# Altium schematic sheet 2. Input Section.SchDoc
size A4; SheetNumber: 2; SheetTotal: 6; PageSetup: Record=PageOptions|CenterHorizontal=True|CenterVertical=True|PrintScale=1.00|XCorrection=1.00|YCorrection=1.00|PrintKind=0|BorderSize=5000000|LeftOffset=0|BottomOffset=0|Orientation=2|PaperLength=1000|PaperWidth=1000|Scale=100|PaperSource=7|PrintQuality=-3|MediaType=1|DitherType=10|PrintScaleMode=1|PaperKind=A4|PaperIndex=9
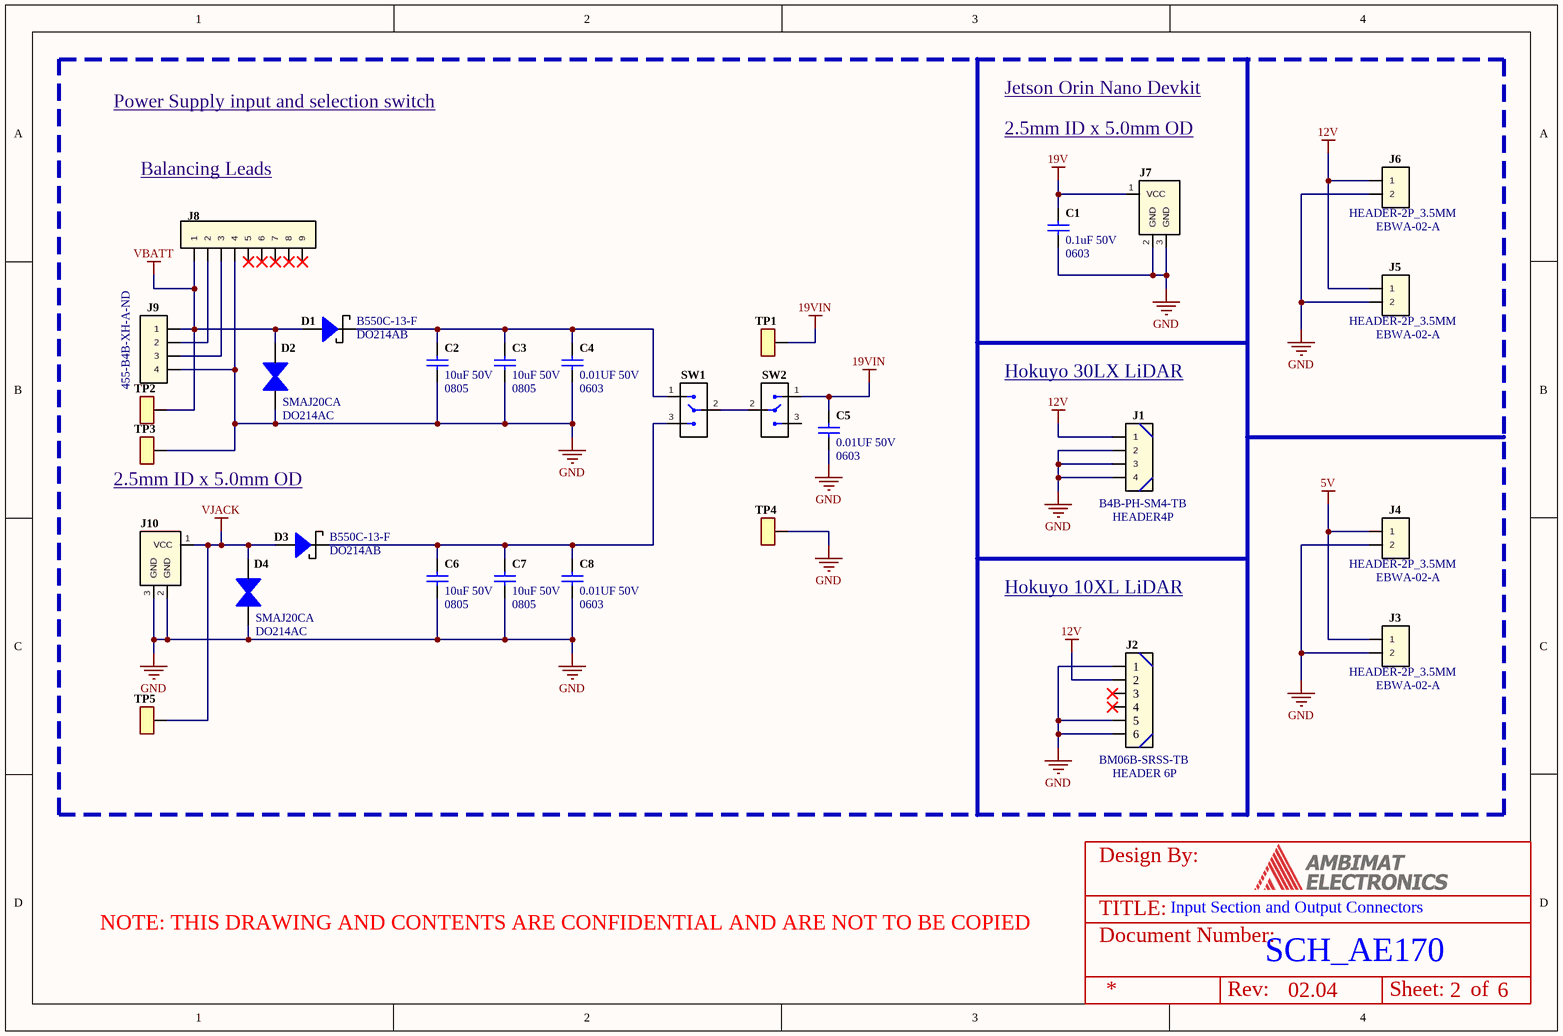
[diagram p0: 2. Input Section.SchDoc]

## Parts
C1  Part Name: 0.1uF 50V  PCB Footprint: 0603  [0603C]  (hidden comment: CAP CER 0.1UF 50V X7R 0603)
C2  Part Name: 10uF 50V  PCB Footprint: 0805  [0805C]  (hidden comment: CAP CER 10UF 50V X5R 0805)
C3  Part Name: 10uF 50V  PCB Footprint: 0805  [0805C]  (hidden comment: CAP CER 10UF 50V X5R 0805)
C4  Part Name: 0.01UF 50V  PCB Footprint: 0603  [0603C]  (hidden comment: CAP CER 10000PF 50V X7R 0603)
C5  Part Name: 0.01UF 50V  PCB Footprint: 0603  [0603C]  (hidden comment: CAP CER 10000PF 50V X7R 0603)
C6  Part Name: 10uF 50V  PCB Footprint: 0805  [0805C]  (hidden comment: CAP CER 10UF 50V X5R 0805)
C7  Part Name: 10uF 50V  PCB Footprint: 0805  [0805C]  (hidden comment: CAP CER 10UF 50V X5R 0805)
C8  Part Name: 0.01UF 50V  PCB Footprint: 0603  [0603C]  (hidden comment: CAP CER 10000PF 50V X7R 0603)
D1  PCB Footprint: DO214AB  Part Name: B550C-13-F  [DO-214AB-SHKY]  (hidden comment: DIODE SCHOTTKY 50V 5A SMC)
D2  PCB Footprint: DO214AC  Part Name: SMAJ20CA  [DO-214AC]  (hidden comment: TVS DIODE 20VWM 32.4VC DO214AC)
D3  PCB Footprint: DO214AB  Part Name: B550C-13-F  [DO-214AB-SHKY]  (hidden comment: DIODE SCHOTTKY 50V 5A SMC)
D4  PCB Footprint: DO214AC  Part Name: SMAJ20CA  [DO-214AC]  (hidden comment: TVS DIODE 20VWM 32.4VC DO214AC)
J1  Manu Part Number: B4B-PH-SM4-TB  Part Name: HEADER4P  [JST_B4B-PH-SM4-TB]  (hidden comment: CONN HEADER SMD 4POS 2MM)
J2  Manu Part Number: BM06B-SRSS-TB  PCB Footprint: HEADER 6P  [BM06B-SRSS-TB_JST]  (hidden comment: CONN HEADER SMD 6POS 1MM)
J3  Manu Part Number: EBWA-02-A  PCB Footprint: HEADER-2P_3.5MM  [Header3.5]  (hidden comment: EURO BLOCK 2P)
J4  Manu Part Number: EBWA-02-A  PCB Footprint: HEADER-2P_3.5MM  [Header3.5]  (hidden comment: EURO BLOCK 2P)
J5  Manu Part Number: EBWA-02-A  PCB Footprint: HEADER-2P_3.5MM  [Header3.5]  (hidden comment: EURO BLOCK 2P)
J6  Manu Part Number: EBWA-02-A  PCB Footprint: HEADER-2P_3.5MM  [Header3.5]  (hidden comment: EURO BLOCK 2P)
J7  CONN PWR JACK 2.5X5.5MM SOLDER  [PJ-050BH]  (value not drawn)
J8  HEADER 1x9  [HEADER-9P_2.54MM]  (value not drawn)
J9  Vendor-1 Part Number: 455-B4B-XH-A-ND  [JST_B4B-XH-A]  (hidden comment: CONN HEADER VERT 4POS 2.5MM)
J10  CONN PWR JACK 2.5X5.5MM SOLDER  [PJ-050BH]  (value not drawn)
SW1  SWITCH TOGGLE SPDT 7.5A 125V  [E101SYZQE]  (value not drawn)
SW2  SWITCH TOGGLE SPDT 7.5A 125V  [E101SYZQE]  (value not drawn)
TP1  TEST POINT  [TP-1.5mmSMD]  (value not drawn)
TP2  TEST POINT  [TP-1.5mmSMD]  (value not drawn)
TP3  TEST POINT  [TP-1.5mmSMD]  (value not drawn)
TP4  TEST POINT  [TP-1.5mmSMD]  (value not drawn)
TP5  TEST POINT  [TP-1.5mmSMD]  (value not drawn)

## Nets
5V: J3.1 J4.1
12V: J1.1 J2.2 J5.1 J6.1
19V: C1.2 J7.1(VCC)
19VIN: C5.1 SW2.1 TP1.1
GND: C1.1 C2.2 C3.2 C4.2 C5.2 C6.2 C7.2 C8.2 D2.1(A) D4.1(A) J1.2 J1.3 J1.4 J2.1 J2.5 J2.6 J3.2 J4.2 J5.2 J6.2 J7.2(GND) J7.3(GND) J8.4 J9.4 J10.2(GND) J10.3(GND) TP3.1 TP4.1
VBATT: D1.2 D2.2(K) J8.1 J9.1 TP2.1
VJACK: D3.2 D4.2(K) J10.1(VCC) TP5.1
NetC2_1: C2.1 C3.1 C4.1 D1.1 SW1.1
NetC6_1: C6.1 C7.1 C8.1 D3.1 SW1.3
NetJ8_2: J8.2 J9.2
NetJ8_3: J8.3 J9.3
NetSW1_2: SW1.2 SW2.2

Not connected (* = marked no-connect by the designer): J2 3* 4*; J8 5* 6* 7* 8* 9*; SW2 3

## Notes on the sheet
- Power Supply input and selection switch
- Jetson Orin Nano Devkit
- Balancing Leads
- 2.5mm ID x 5.0mm OD
- Hokuyo 30LX LiDAR
- (near TP3) 2.5mm ID x 5.0mm OD
- Hokuyo 10XL LiDAR
- Input Section and Output Connectors
- SCH_AE170
- 02.04
- TITLE:
- Design By:
- NOTE: THIS DRAWING AND CONTENTS ARE CONFIDENTIAL AND ARE NOT TO BE COPIED
- Document Number:
- Rev:
- Sheet:
- of

## Library data of the parts
C1 = CS0.1uF-50V0603: Manu Part Number: CC0603KRX7R9BB104; Manufacturer: Yageo; Vendor-1 Part Number: 311-1344-1-ND; Type: SMD; Vendor-1: DIGIKEY; Vendor-2: MOUSER; Lead Free: YES; Mounting: YES; RoHS Compliant: YES
C2 C3 C6 C7 = CS10uF-50V0805: Manu Part Number: GRM21BR61H106KE43L; Manufacturer: Murata Electronics; Vendor-1 Part Number: 490-18663-1-ND; Type: SMD; Vendor-1: DIGIKEY; Vendor-2: FARNELL; Help URL: *; Lead Free: YES; Mounting: YES; RoHS Compliant: YES
C4 C5 C8 = CS0.01uF-50V0603: Manu Part Number: CC0603KPX7R9BB103; Manufacturer: Yageo; Vendor-1 Part Number: 311-1572-1-ND; Type: SMD; Vendor-1: DIGIKEY; Vendor-2: FARNELL; Lead Free: YES; Mounting: YES; RoHS Compliant: YES
D1 D3 = DS-B550C-13-F: Manufacturer: Diodes Incorporated; Vendor-1 Part Number: B550C-FDICT-ND; Type: SMD; Vendor-1: DIGI-KEY; Vendor-2: MOUSER; Help URL: *; Lead Free: YES; Mounting: YES; Manu Part Number: B550C-13-F
D2 D4 = DS-SMAJ20CA: Manufacturer: Littelfuse Inc.; Vendor-1 Part Number: SMAJ20CALFCT-ND; Type: SMD; Vendor-1: DIGI-KEY; Vendor-2: MOUSER; Help URL: *; Lead Free: YES; Mounting: YES; Manu Part Number: SMAJ20CA
J1 = CON2.0P-4x1SMT: Manufacturer: JST Sales America Inc.; Vendor-1 Part Number: 455-B4B-PH-SM4-TBCT-ND; PCB Footprint: HEADER-4P_2.0MM; Vendor-1: DIGIKEY; Vendor-2: FARNELL; Mounting: YES; RoHS Compliant: YES; Type: SMT; Lead Free: YES
J2 = CON1.0P-6x1 SMT: Manufacturer: JST Sales America Inc.; Vendor-1 Part Number: 455-BM06B-SRSS-TBCT-ND; Vendor-1: DIGIKEY; Vendor-2: FARNELL; Mounting: YES; Part Name: BM06B-SRSS-TB; RoHS Compliant: YES; Type: SMD; Lead Free: YES
J3-J6 = CON3.5P-2x1TH_STRT: Manufacturer: Adam Tech; Part Name: HEADER2P; Vendor-1 Part Number: 2057-EBWA-02-A-ND; Vendor-1: DIGIKEY; Vendor-2: FARNELL; Mounting: YES; RoHS Compliant: YES; Type: TH; Lead Free: YES
J7 J10 = CON3P-PJ-050BH: Manufacturer: CUI Inc; Vendor-1 Part Number: CP-050BH-ND; PCB Footprint: TH 3P; Vendor-1: DIGIKEY; Vendor-2: FARNELL; Lead Free: YES; Mounting: YES; Type: TH; Manu Part Number: PJ-050BH; Part Name: PJ-050BH; PCB Footprint: JACK; RoHS Compliant: YES
J8 = CON2.54P-1x9: CONN HEADER 9PS 2.54MM; Part Name: 2.54MM HEADER; PCB Footprint: 1x9 2.54MM HEADER; Vendor-1: DIGIKEY; Mounting: YES; RoHS Compliant: YES; Type: TH; Lead Free: YES
J9 = CON2.5P-4x1TH: Manu Part Number: B4B-XH-A; Manufacturer: JST Sales America Inc.; Part Name: HEADER4P; PCB Footprint: HEADER-4P_2.5MM; Vendor-1: DIGIKEY; Vendor-2: FARNELL; Mounting: YES; RoHS Compliant: YES; Type: TH; Lead Free: YES
SW1 SW2 = SW-E101SYZQE: Manufacturer: C&K; Vendor-1 Part Number: CKN1519-ND; Vendor-1: DIGI-KEY; Vendor-2: MOUSER; Lead Free: YES; Mounting: YES; RoHS Compliant: YES; Manu Part Number: E101SYZQE; Part Name: E101SYZQE; PCB Footprint: E101SYZQE; Type: TH
TP1-TP5 = TP-1.5mmSMD: SMD TEST POINT